# Altium project SLT.PrjPcb (part 3 of 3)
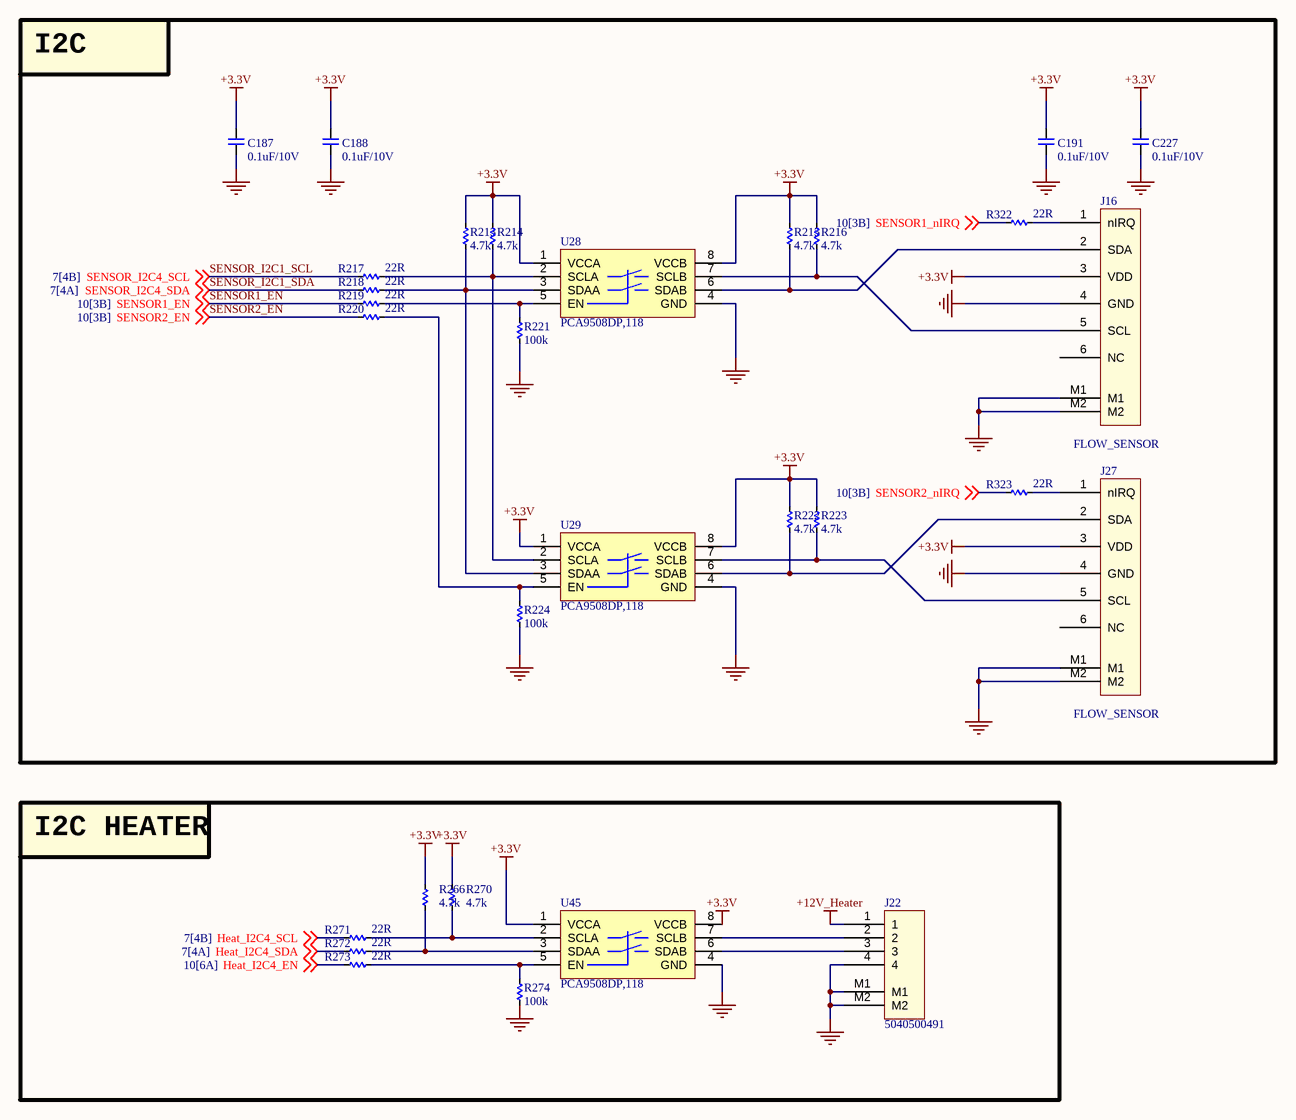
[diagram p26: I2C_Sensor.SchDoc]

## Nets that join several sheets
+1.8V: POWER (C38.1 U9.5), SOM_BOOT (R239.1), IO_EXPAND (14 pins), ADC (C245.2 U44.40)
+3.3V: CONNECTOR (8 pins), POWER (8 pins), SOM_POWER (5 pins), SOM_BOOT (C189.2 R238.2 R241.2 U30.1), SOM_Console (8 pins), IO_EXPAND (32 pins), CAN_I2C (12 pins), USB (8 pins), LED (7 pins), TEC (12 pins), FLUIDIC_CTRL (C234.2 R191.1 R192.1 U43.1), ADC (10 pins), I2C_Sensor (20 pins)
+5V_CAM: CONNECTOR (J15.15), POWER_2 (7 pins)
+5V_HD4: POWER (7 pins), FLUIDIC_CTRL (18 pins)
+5V_OUT: POWER (13 pins), POWER_2 (C232.2 JP7.1 R301.2 U42.5)
+5V_SOM: CONNECTOR (C10.2 D29.5), POWER (15 pins), POWER_2 (R305.2), SOM_POWER (32 pins), SOM_BOOT (JP10.1)
+5V_TEC: POWER (7 pins), TEC (20 pins)
+12V_IN: CONNECTOR (J2.1), POWER (13 pins)
+12V_Laser: CONNECTOR (J7.1), LED (5 pins)
+12V_Solenoid: CONNECTOR (8 pins), POWER (7 pins), FLUIDIC_CTRL (8 pins)
+V_BAT_RTC: SOM_POWER (P1.93), USB (R89.1 R276.1)
+VSD_3V3: SOM_POWER (P1.17), SOM_BOOT (R240.1)
GND: CONNECTOR (27 pins), POWER (91 pins), POWER_2 (10 pins), SOM_POWER (46 pins), SOM_BOOT (26 pins), SOM_Console (8 pins), IO_EXPAND (38 pins), CAN_I2C (11 pins), USB (39 pins), LED (13 pins), TEC (52 pins), HEATER (12 pins), NTC (44 pins), FLUIDIC_CTRL (42 pins), ADC (60 pins), I2C_Sensor (19 pins)
HEATER_A_1: CONNECTOR (J13.1 J13.3 J13.5 J13.7), POWER (7 pins), HEATER (8 pins), I2C_Sensor (J22.1)
NTC1+: CONNECTOR (8 pins), POWER (10 pins), USB (8 pins), NTC (20 pins), ADC (8 pins)
ADC2_nERROR: IO_EXPAND (U40.20), ADC (R300.1 R354.1)
ADC2_nSYNC: IO_EXPAND (U34.18), ADC (R294.1)
ADC2_SPI_nCS: IO_EXPAND (U34.19), ADC (R290.1)
ADC_nERROR: IO_EXPAND (U40.19), ADC (R299.1 R352.1)
ADC_nSYNC: IO_EXPAND (U38.20), ADC (R288.1)
ADC_SPI_nCS: IO_EXPAND (U38.21), ADC (R281.1)
ADC_TEMP1: NTC (C147.2 R157.2), ADC (C76.2 U41.31)
ADC_TEMP2: NTC (C155.2 R163.2), ADC (C78.2 U41.29)
ADC_TEMP3: NTC (C163.2 R169.2), ADC (C84.2 U41.26)
ADC_TEMP4: NTC (C171.2 R175.2), ADC (C79.2 U41.28)
ADC_TEMP5: NTC (C149.2 R159.2), ADC (C75.2 U41.32)
ADC_TEMP6: NTC (C157.2 R165.2), ADC (C77.2 U41.30)
ADC_TEMP7: NTC (C165.2 R171.2), ADC (C239.2 U41.34)
ADC_TEMP8: NTC (C173.2 R177.2), ADC (C83.2 U41.27)
CAN_H: CONNECTOR (J2.3), CAN_I2C (R96.2 U12.7 U35.7)
CAN_L: CONNECTOR (J2.4), CAN_I2C (R98.1 U12.6 U35.6)
COM_LASER_DAC_CS: SOM_POWER (P2.59), IO_EXPAND (U10.9)
COM_PHOTO_ADC_CONV: SOM_POWER (P2.74), IO_EXPAND (U14.8)
COMM_PWR_EN: CONNECTOR (R70.1), SOM_POWER (P1.95)
CONSOLE_UART1_RX: SOM_POWER (P1.76), SOM_Console (R90.2 R128.1)
CONSOLE_UART1_TX: SOM_POWER (P1.74), SOM_Console (R72.1 R127.2)
CONSOLE_UART2_RX: SOM_POWER (P1.19), SOM_Console (R91.1 R253.2)
CONSOLE_UART2_TX: SOM_POWER (P1.72), SOM_Console (R92.1 R254.2)
DSUB_I2C_EN: IO_EXPAND (U38.14), CAN_I2C (R107.2)
DSUB_I2C_SCL: CONNECTOR (J2.5), CAN_I2C (R104.1)
DSUB_I2C_SDA: CONNECTOR (J2.6), CAN_I2C (R106.1)
eFUSE_ILIM_5V_CAM: POWER_2 (R308.2 U42.9), ADC (C179.2 U44.5)
eFUSE_ILIM_5V_HD4: POWER (R41.2 U5.9), ADC (C89.2 U44.28)
eFUSE_ILIM_5V_IO: POWER (R25.2 U3.9), ADC (C175.2 U44.32)
eFUSE_ILIM_5V_TEC: POWER (R52.2 U7.9), ADC (C86.2 U44.31)
eFUSE_ILIM_12V: POWER (R10.2 U2.9), ADC (C87.2 U44.30)
eFUSE_ILIM_12V_Heater: POWER (R26.2 U4.9), ADC (C88.2 U44.29)
eFUSE_ILIM_12V_Solenoid: POWER (R42.2 U6.9), ADC (C85.2 U44.33)
HD_I2C_EN: IO_EXPAND (U10.14), FLUIDIC_CTRL (R122.1 U43.5)
Heat_I2C4_EN: IO_EXPAND (U11.4), I2C_Sensor (R273.2)
HEATER_B_1: CONNECTOR (J13.2), HEATER (D32.2 Q1.3)
HEATER_B_2: CONNECTOR (J13.4), HEATER (D35.2 Q3.3)
HEATER_B_3: CONNECTOR (J13.6), HEATER (D33.2 Q2.3)
HEATER_B_4: CONNECTOR (J13.8), HEATER (D34.2 Q4.3)
HEATER_PWM_1: SOM_POWER (P1.81), HEATER (R149.1)
HEATER_PWM_2: SOM_POWER (P1.79), HEATER (R153.1)
HEATER_PWM_3: SOM_POWER (P1.89), HEATER (R150.1)
HEATER_PWM_4: SOM_POWER (P1.100), HEATER (R154.1)
I2C4_SCL: CONNECTOR (R297.1), SOM_POWER (P1.32), I2C_Sensor (R217.2 R271.2)
I2C4_SDA: CONNECTOR (R298.1), SOM_POWER (P1.30), I2C_Sensor (R218.2 R272.2)
JTAG_TCK: SOM_POWER (P1.73), SOM_BOOT (J20.3)
JTAG_TDI: SOM_POWER (P1.71), SOM_BOOT (J20.7)
JTAG_TDO: SOM_POWER (P1.67), SOM_BOOT (J20.5)
JTAG_TMS: SOM_POWER (P1.65), SOM_BOOT (J20.1)
LASER_ADC_1: CONNECTOR (R71.1), SOM_POWER (C19.1 P2.91)
LASER_ADC_2: CONNECTOR (R97.1), SOM_POWER (C65.1 P2.89)
LASER_DAC_CS: CONNECTOR (R67.1 R86.2), IO_EXPAND (U10.15)
LASER_DAC_LATCH: CONNECTOR (R68.1 R87.2), IO_EXPAND (U10.18)
LASER_SW_EXT_CS: CONNECTOR (R94.1 R255.2), IO_EXPAND (U10.16)
LASER_SW_INT_CS: CONNECTOR (R69.1 R88.2), IO_EXPAND (U10.17)
LED_nLDAC: IO_EXPAND (U10.20), LED (R264.1 U36.8)
LED_SPI_nCS: IO_EXPAND (U10.21), LED (R260.2 U36.3)
NTC1-: CONNECTOR (J3.2), NTC (R158.1 R161.2)
NTC2-: CONNECTOR (J3.4), NTC (R164.1 R167.2)
NTC3-: CONNECTOR (J3.6), NTC (R170.1 R173.2)
NTC4-: CONNECTOR (J3.8), NTC (R176.1 R179.2)
NTC5-: CONNECTOR (J29.2), NTC (R160.1 R162.2)
NTC6-: CONNECTOR (J29.4), NTC (R166.1 R168.2)
NTC7-: CONNECTOR (J29.6), NTC (R172.1 R174.2)
NTC8-: CONNECTOR (J29.8), NTC (R178.1 R180.2)
PHOTO_ADC_CONV: CONNECTOR (R62.1 R256.2), IO_EXPAND (U14.16)
PHOTO_ADC_CS: CONNECTOR (R61.1 R85.2), IO_EXPAND (U14.17)
PHOTO_ADC_EOC: CONNECTOR (R63.1 R275.2), IO_EXPAND (U40.18)
PHOTO_SPI7_MISO: CONNECTOR (R59.1), SOM_POWER (P2.56)
PHOTO_SPI7_MOSI: CONNECTOR (R58.1), SOM_POWER (P2.52)
PHOTO_SPI7_SCK: CONNECTOR (R57.1), SOM_POWER (P1.98)
PHOTO_SW_CS: CONNECTOR (R60.1 R84.2), SOM_POWER (P2.58)
POR_B_3P3: SOM_POWER (P2.66 R77.2), SOM_BOOT (R252.2)
POW_ONOFF_CAM: POWER_2 (R304.2), IO_EXPAND (U11.9)
POW_ONOFF_HD4: POWER (R31.2), IO_EXPAND (U11.7)
POW_ONOFF_Heater: POWER (R18.2), IO_EXPAND (U11.5)
POW_ONOFF_IO: POWER (R15.2), SOM_POWER (P1.60)
POW_ONOFF_Solenoid: POWER (R37.2), IO_EXPAND (U11.6)
POW_ONOFF_TEC: POWER (R47.2), IO_EXPAND (U11.8)
SD2_CLK: SOM_POWER (P2.96), SOM_BOOT (R249.1)
SD2_CMD: SOM_POWER (P2.100), SOM_BOOT (R250.1)
SD2_DATA0: SOM_POWER (P2.97), SOM_BOOT (R242.1)
SD2_DATA1: SOM_POWER (P2.99), SOM_BOOT (R243.1)
SD2_DATA2: SOM_POWER (P2.94), SOM_BOOT (R245.1)
SD2_DATA3: SOM_POWER (P2.98), SOM_BOOT (R247.1)
SD2_nCD: SOM_POWER (P2.92), SOM_BOOT (J21.P9 R248.2)
SENSOR1_EN: IO_EXPAND (U34.20), I2C_Sensor (R219.2)
SENSOR2_EN: IO_EXPAND (U34.21), I2C_Sensor (R220.2)
SOLENOID_A_1: CONNECTOR (J4.2), FLUIDIC_CTRL (DZ1.1 Q5.3)
SOLENOID_A_2: CONNECTOR (J4.4), FLUIDIC_CTRL (DZ2.1 Q8.3)
SOLENOID_A_3: CONNECTOR (J4.6), FLUIDIC_CTRL (DZ3.1 Q9.3)
SOLENOID_A_4: CONNECTOR (J4.8), FLUIDIC_CTRL (DZ4.1 Q6.3)
SOLENOID_A_5: CONNECTOR (J6.2), FLUIDIC_CTRL (DZ5.1 Q7.3)
SOLENOID_A_6: CONNECTOR (J6.4), FLUIDIC_CTRL (DZ6.1 Q10.3)
SOLENOID_A_7: CONNECTOR (J6.6), FLUIDIC_CTRL (DZ7.1 Q11.3)
SOLENOID_A_8: CONNECTOR (J6.8), FLUIDIC_CTRL (DZ8.1 Q12.3)
SOLENOID_CTR_1: IO_EXPAND (U16.13), FLUIDIC_CTRL (R197.2)
SOLENOID_CTR_2: IO_EXPAND (U16.14), FLUIDIC_CTRL (R200.2)
SOLENOID_CTR_3: IO_EXPAND (U16.15), FLUIDIC_CTRL (R201.2)
SOLENOID_CTR_4: IO_EXPAND (U16.16), FLUIDIC_CTRL (R198.2)
SOLENOID_CTR_5: IO_EXPAND (U16.17), FLUIDIC_CTRL (R199.2)
SOLENOID_CTR_6: IO_EXPAND (U16.18), FLUIDIC_CTRL (R207.2)
SOLENOID_CTR_7: IO_EXPAND (U16.19), FLUIDIC_CTRL (R208.2)
SOLENOID_CTR_8: IO_EXPAND (U16.20), FLUIDIC_CTRL (R209.2)
SOM_ADC2_nERROR: SOM_POWER (P2.84), IO_EXPAND (U40.5)
SOM_ADC2_nSYNC: SOM_POWER (P2.73), IO_EXPAND (U34.6)
SOM_ADC2_SPI_nCS: SOM_POWER (P2.75), IO_EXPAND (U34.5)
SOM_ADC_nERROR: SOM_POWER (P2.80), IO_EXPAND (U40.4)
SOM_ADC_nSYNC: SOM_POWER (P2.38), IO_EXPAND (U38.4)
SOM_ADC_SPI_nCS: SOM_POWER (P2.36), IO_EXPAND (U38.3)
SOM_CAM_CK_N: CONNECTOR (R194.1), SOM_POWER (P2.30)
SOM_CAM_CK_P: CONNECTOR (R195.1), SOM_POWER (P2.32)
SOM_CAM_D0_N: CONNECTOR (R123.1), SOM_POWER (P2.31)
SOM_CAM_D0_P: CONNECTOR (R189.1), SOM_POWER (P2.33)
SOM_CAM_D1_N: CONNECTOR (R190.1), SOM_POWER (P2.35)
SOM_CAM_D1_P: CONNECTOR (R193.1), SOM_POWER (P2.37)
SOM_CAM_I2C3_SCL: CONNECTOR (R74.2 R196.1), SOM_POWER (P1.94)
SOM_CAM_I2C3_SDA: CONNECTOR (R75.2 R295.1), SOM_POWER (P1.91)
SOM_CAN1_RX: SOM_POWER (P1.23), CAN_I2C (R265.1)
SOM_CAN1_TX: SOM_POWER (P1.21), CAN_I2C (R258.1)
SOM_CAN2_RX: SOM_POWER (P1.49), CAN_I2C (R95.1)
SOM_CAN2_TX: SOM_POWER (P1.33), CAN_I2C (R93.1)
SOM_DSUB_I2C_EN: SOM_POWER (P2.45), IO_EXPAND (U38.10)
SOM_HD42_I2C8_SCL: SOM_POWER (P1.37), FLUIDIC_CTRL (R191.2 R279.2)
SOM_HD42_I2C8_SDA: SOM_POWER (P1.35), FLUIDIC_CTRL (R192.2 R280.2)
SOM_HD_I2C_EN: SOM_POWER (P2.61), IO_EXPAND (U10.10)
SOM_I2C5_SCL: SOM_POWER (P1.26), CAN_I2C (R103.2)
SOM_I2C5_SDA: SOM_POWER (P1.28), CAN_I2C (R105.2)
SOM_IOX_I2C7_SCL: SOM_POWER (P1.41), IO_EXPAND (R312.1 R319.1)
SOM_IOX_I2C7_SDA: SOM_POWER (P1.39), IO_EXPAND (R311.1 R318.1)
SOM_LASER_DAC_LATCH: SOM_POWER (P2.47), IO_EXPAND (U10.6)
SOM_LASER_SW_EXT_CS: SOM_POWER (P2.55), IO_EXPAND (U10.8)
SOM_LASER_SW_INT_CS: SOM_POWER (P2.53), IO_EXPAND (U10.7)
SOM_LED_nLDAC: SOM_POWER (P2.43), IO_EXPAND (U10.4)
SOM_LED_SPI_nCS: SOM_POWER (P2.41), IO_EXPAND (U10.3)
SOM_PHOTO_ADC_CS: SOM_POWER (P2.70), IO_EXPAND (U14.7)
SOM_PHOTO_ADC_EOC: SOM_POWER (P2.86), IO_EXPAND (U40.6)
SOM_SENSOR1_EN: SOM_POWER (P2.77), IO_EXPAND (U34.4)
SOM_SENSOR2_EN: SOM_POWER (P2.79), IO_EXPAND (U34.3)
SOM_TEC_nCS_1: SOM_POWER (P2.69), IO_EXPAND (U34.7)
SOM_TEC_nCS_2: SOM_POWER (P2.67), IO_EXPAND (U34.8)
SOM_TEC_nCS_3: SOM_POWER (P2.65), IO_EXPAND (U34.9)
SOM_TEC_nCS_4: SOM_POWER (P2.63), IO_EXPAND (U34.10)
SOM_TEC_SPI6_MISO: SOM_POWER (P1.59), TEC (U18.18 U19.18 U20.18 U21.18), ADC (R286.1 R292.1)
SOM_TEC_SPI6_MOSI: SOM_POWER (P1.61), TEC (U18.17 U19.17 U20.17 U21.17), ADC (R287.1 R293.1)
SOM_TEC_SPI6_SCK: SOM_POWER (P1.63), TEC (U18.16 U19.16 U20.16 U21.16), ADC (R282.1 R291.1)
SOM_USB_PWR_EN1: SOM_POWER (P2.42), IO_EXPAND (U38.6)
SOM_USB_PWR_EN2: SOM_POWER (P2.44), IO_EXPAND (U38.7)
SOM_USB_PWR_EN3: SOM_POWER (P2.48), IO_EXPAND (U38.8)
SOM_USB_PWR_EN4: SOM_POWER (P2.50), IO_EXPAND (U38.9)
SOM_USB_PWR_nOC1: SOM_POWER (P2.85), IO_EXPAND (U40.7)
SOM_USB_PWR_nOC2: SOM_POWER (P2.83), IO_EXPAND (U40.8)
SOM_USB_PWR_nOC3: SOM_POWER (P2.81), IO_EXPAND (U40.9)
SOM_USB_PWR_nOC4: SOM_POWER (P2.78), IO_EXPAND (U40.3)
SOM_USB_SW_nOE: SOM_POWER (P2.60), IO_EXPAND (U14.3)
SOM_USB_SW_SEL0: SOM_POWER (P2.68), IO_EXPAND (U14.5)
SOM_USB_SW_SEL1: SOM_POWER (P2.62), IO_EXPAND (U14.4)
SOM_USB_USB2_N: SOM_POWER (P1.5), USB (U27.3)
SOM_USB_USB2_P: SOM_POWER (P1.3), USB (U27.2)
SPI1_MISO: CONNECTOR (R65.1), SOM_POWER (P1.51)
SPI1_MOSI: CONNECTOR (R64.1), SOM_POWER (P1.45), LED (U36.5)
SPI1_SCK: CONNECTOR (R66.1), SOM_POWER (P1.53), LED (U36.4)
SYS_nRST_PMIC: SOM_POWER (P1.2 R76.2), SOM_BOOT (R251.2)
TEC_ADC_1: TEC (U18.20), ADC (C73.2 U41.33)
TEC_ADC_2: TEC (U20.20), ADC (C230.2 U41.37)
TEC_ADC_3: TEC (U19.20), ADC (C236.2 U41.35)
TEC_ADC_4: TEC (U21.20), ADC (C231.2 U41.36)
TEC_EN_1: IO_EXPAND (U16.8), TEC (R133.2)
TEC_EN_2: IO_EXPAND (U16.9), TEC (R143.2)
TEC_EN_3: IO_EXPAND (U16.10), TEC (R134.2)
TEC_EN_4: IO_EXPAND (U16.11), TEC (R144.2)
TEC_nCS_1: IO_EXPAND (U34.17), TEC (R129.2 U18.15)
TEC_nCS_2: IO_EXPAND (U34.16), TEC (R139.2 U20.15)
TEC_nCS_3: IO_EXPAND (U34.15), TEC (R130.2 U19.15)
TEC_nCS_4: IO_EXPAND (U34.14), TEC (R140.2 U21.15)
TEC_OUT_A_1: CONNECTOR (J14.2), TEC (C94.2 C95.2 C106.2 U18.8,9)
TEC_OUT_A_2: CONNECTOR (J14.6), TEC (C116.2 C117.2 C128.2 U20.8,9)
TEC_OUT_A_3: CONNECTOR (J14.4), TEC (C96.2 C97.2 C107.2 U19.8,9)
TEC_OUT_A_4: CONNECTOR (J14.8), TEC (C118.2 C119.2 C129.2 U21.8,9)
TEC_OUT_B_1: CONNECTOR (J14.1), TEC (C106.1 C112.2 L3.2 U18.12)
TEC_OUT_B_2: CONNECTOR (J14.5), TEC (C128.1 C134.2 L5.2 U20.12)
TEC_OUT_B_3: CONNECTOR (J14.3), TEC (C107.1 C113.2 L4.2 U19.12)
TEC_OUT_B_4: CONNECTOR (J14.7), TEC (C129.1 C135.2 L6.2 U21.12)
TEC_SWEN_1: IO_EXPAND (U16.4), TEC (R131.1)
TEC_SWEN_2: IO_EXPAND (U16.5), TEC (R141.1)
TEC_SWEN_3: IO_EXPAND (U16.6), TEC (R132.1)
TEC_SWEN_4: IO_EXPAND (U16.7), TEC (R142.1)
USB1_DETECT: SOM_POWER (P1.24), SOM_BOOT (R226.1 R228.2)
USB1_ID: SOM_POWER (P1.22), SOM_BOOT (R227.1 R229.2)
USB1_N: SOM_POWER (P1.14), SOM_BOOT (U30.4)
USB1_P: SOM_POWER (P1.12), SOM_BOOT (U30.3)
USB_D_N: CONNECTOR (D29.6), SOM_BOOT (U30.6)
USB_D_P: CONNECTOR (D29.4), SOM_BOOT (U30.7)
USB_PWR_EN1: IO_EXPAND (U38.18), USB (R118.1 U15.1)
USB_PWR_EN2: IO_EXPAND (U38.17), USB (R117.1 U15.4)
USB_PWR_EN3: IO_EXPAND (U38.16), USB (R121.1 U17.1)
USB_PWR_EN4: IO_EXPAND (U38.15), USB (R120.1 U17.4)
USB_PWR_nOC1: IO_EXPAND (U40.17), USB (R348.2 U15.2)
USB_PWR_nOC2: IO_EXPAND (U40.16), USB (R349.2 U15.3)
USB_PWR_nOC3: IO_EXPAND (U40.15), USB (R350.2 U17.2)
USB_PWR_nOC4: IO_EXPAND (U40.21), USB (R351.2 U17.3)
USB_SW_nOE: IO_EXPAND (U14.21), USB (R114.2 U27.15)
USB_SW_SEL0: IO_EXPAND (U14.19), USB (R116.1 U27.6)
USB_SW_SEL1: IO_EXPAND (U14.20), USB (R115.1 U27.5)